# EAGLE design p (EAGLE 7.1.0)
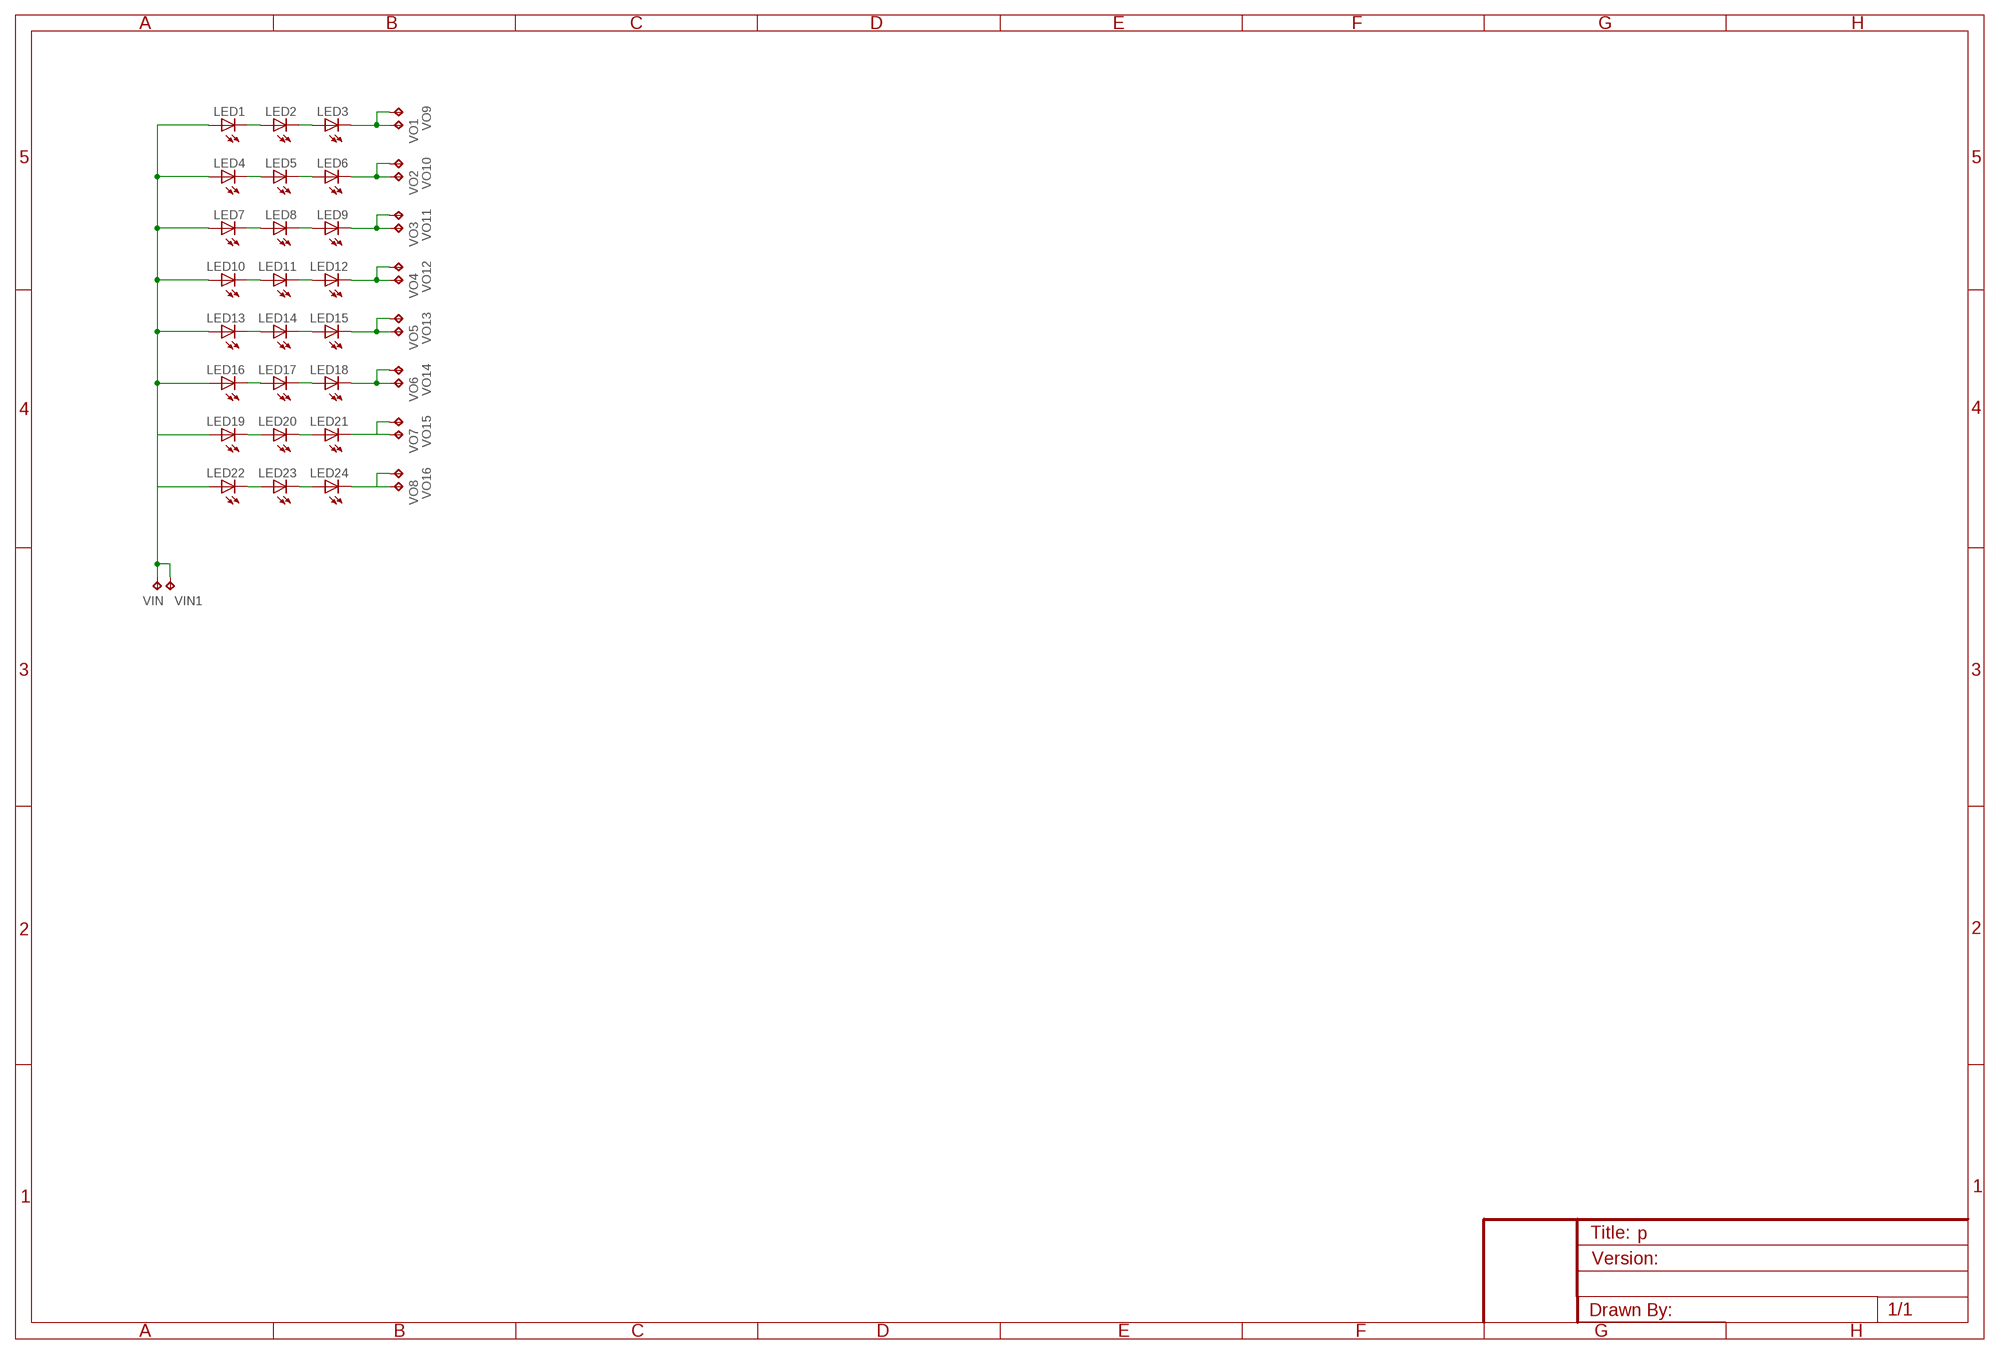
[diagram p0: schematic, sheet 1]

## Parts
LED1  LED0805  [LED_0805]
LED2  LED0805  [LED_0805]
LED3  LED0805  [LED_0805]
LED4  LED0805  [LED_0805]
LED5  LED0805  [LED_0805]
LED6  LED0805  [LED_0805]
LED7  LED0805  [LED_0805]
LED8  LED0805  [LED_0805]
LED9  LED0805  [LED_0805]
LED10  LED0805  [LED_0805]
LED11  LED0805  [LED_0805]
LED12  LED0805  [LED_0805]
LED13  LED0805  [LED_0805]
LED14  LED0805  [LED_0805]
LED15  LED0805  [LED_0805]
LED16  LED0805  [LED_0805]
LED17  LED0805  [LED_0805]
LED18  LED0805  [LED_0805]
LED19  LED0805  [LED_0805]
LED20  LED0805  [LED_0805]
LED21  LED0805  [LED_0805]
LED22  LED0805  [LED_0805]
LED23  LED0805  [LED_0805]
LED24  LED0805  [LED_0805]
VIN  TEST_POINTPAD1-20  [P1-20]
VIN1  TEST_POINTPAD1-20  [P1-20]
VO1  TEST_POINTPAD1-20  [P1-20]
VO2  TEST_POINTPAD1-20  [P1-20]
VO3  TEST_POINTPAD1-20  [P1-20]
VO4  TEST_POINTPAD1-20  [P1-20]
VO5  TEST_POINTPAD1-20  [P1-20]
VO6  TEST_POINTPAD1-20  [P1-20]
VO7  TEST_POINTPAD1-20  [P1-20]
VO8  TEST_POINTPAD1-20  [P1-20]
VO9  TEST_POINTPAD1-20  [P1-20]
VO10  TEST_POINTPAD1-20  [P1-20]
VO11  TEST_POINTPAD1-20  [P1-20]
VO12  TEST_POINTPAD1-20  [P1-20]
VO13  TEST_POINTPAD1-20  [P1-20]
VO14  TEST_POINTPAD1-20  [P1-20]
VO15  TEST_POINTPAD1-20  [P1-20]
VO16  TEST_POINTPAD1-20  [P1-20]

## Nets
N$1: LED2.C LED3.A
N$2: LED1.C LED2.A
N$3: LED19.C LED20.A
N$4: LED20.C LED21.A
N$5: LED5.C LED6.A
N$6: LED4.C LED5.A
N$7: LED22.C LED23.A
N$8: LED23.C LED24.A
N$9: LED8.C LED9.A
N$10: LED7.C LED8.A
N$11: LED24.C VO8.TP VO16.TP
N$12: LED21.C VO7.TP VO15.TP
N$13: LED11.C LED12.A
N$14: LED10.C LED11.A
N$17: LED14.C LED15.A
N$18: LED13.C LED14.A
N$21: LED17.C LED18.A
N$22: LED16.C LED17.A
VIN: LED1.A LED4.A LED7.A LED10.A LED13.A LED16.A LED19.A LED22.A VIN1.TP VIN.TP
VOUT1: LED3.C VO1.TP VO9.TP
VOUT2: LED6.C VO2.TP VO10.TP
VOUT3: LED9.C VO3.TP VO11.TP
VOUT4: LED12.C VO4.TP VO12.TP
VOUT5: LED15.C VO5.TP VO13.TP
VOUT6: LED18.C VO6.TP VO14.TP

## Library data of the parts
LED1-LED24 = CyberRailGuru:LED: LEDs Standard schematic elements and footprints for 5mm, 3mm, 1206, and 0603 sized LEDs. 5mm - Spark Fun Electronics SKU : COM-00529 (and others)
VIN VIN1 VO1-VO16 = CyberRailGuru:TEST_POINT: Test pad

## Board
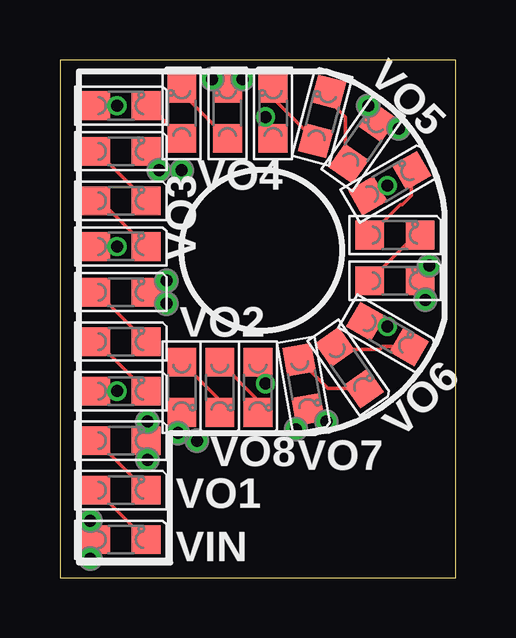
[diagram p1: board, top side]
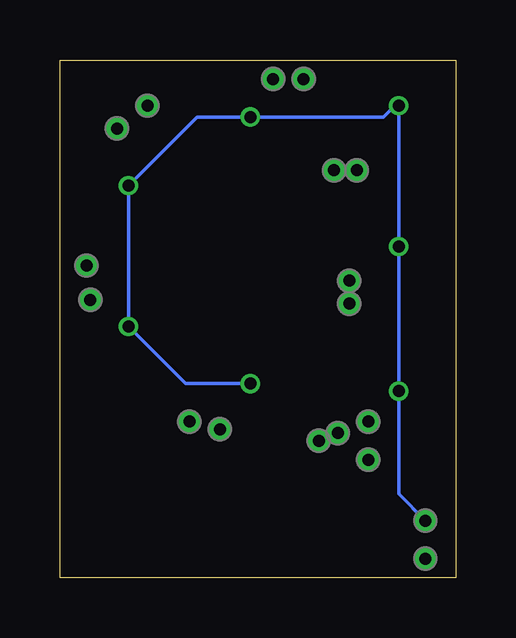
[diagram p2: board, bottom side, seen from below]

Size 16.51 x 21.59 mm. Coordinates in mm from the lower left corner, seen from the top.
Outline: 0,0 16.51,0 16.51,21.59 0,21.59 0,0
Copper layers (1*16): Top 0.035mm / dielectric 1.5mm / Bottom 0.035mm
Design rules "Fusion_eagle_rule_v1.1_tms *": minimum track width 6mil, minimum drill 12mil, track to track 6mil, track to pad 6mil, pad to pad 6mil, via to via 6mil, smd to smd 0mil, copper to edge 10mil, drill to drill 10mil, minimum pad ring 10mil, minimum via ring 6mil, stop-mask expansion 2mil, vias tented up to drill 100mil, thermal gap 10mil

### Footprints (pad centres in the part's own frame; a part is rotated, then mirrored left to right if it is on the bottom)
LED_0805 = smd 1.2 x 1.2: A 0,-1.05; C 0,1.05
P1-20 = drill 0.5: TP 0,0

### Placement (x,y rotation side)
LED1  2.54,1.59 270 top
LED2  2.54,3.65 270 top
LED3  2.54,5.71 270 top
LED4  2.54,7.78 270 top
LED5  2.54,9.84 270 top
LED6  2.54,11.91 270 top
LED7  2.54,13.81 270 top
LED8  2.54,15.72 270 top
LED9  2.54,17.78 270 top
LED10  2.54,19.68 270 top
LED11  5.08,19.37 0 top
LED12  6.99,19.37 0 top
LED13  8.89,19.37 0 top
LED14  10.94,19.24 345 top
LED15  12.64,18.13 325 top
LED16  13.75,16.45 300 top
LED17  13.97,14.29 270 top
LED18  13.97,12.38 270 top
LED19  13.65,10.16 240 top
LED20  12.07,8.76 215 top
LED21  10.17,8.05 190 top
LED22  8.26,7.94 180 top
LED23  6.67,7.94 180 top
LED24  5.08,7.94 180 top
VIN  1.27,0.79 180 top
VIN1  1.27,2.38 0 top
VO1  3.65,4.92 180 top
VO2  4.45,11.43 180 top
VO3  4.13,16.99 180 top
VO4  6.35,20.8 180 top
VO5  14.13,18.73 180 top
VO6  15.24,11.59 180 top
VO7  11.11,6.51 0 top
VO8  5.71,5.71 0 top
VO9  3.65,6.51 0 top
VO10  4.45,12.38 0 top
VO11  5.08,16.99 0 top
VO12  7.62,20.8 0 top
VO13  12.86,19.68 0 top
VO14  15.4,13.02 0 top
VO15  9.84,6.19 0 top
VO16  4.92,6.03 0 top

### Tracks (layer width: path | path; a pad name or v marks a point on that pad's centre or on a via)
N$1
  Top 0.152: LED3.A 1.53,5.71 LED2.C
N$2
  Top 0.152: LED2.A 1.53,3.65 LED1.C
N$3
  Top 0.152: LED19.C 13.45,9.63 13.34,9.53 11.56,9.53 LED20.A
N$4
  Top 0.152: LED20.C 11.17,7.9 LED21.A
N$5
  Top 0.152: LED6.A 1.53,11.91 LED5.C
N$6
  Top 0.152: LED5.A 1.53,9.84 LED4.C
N$7
  Top 0.152: LED22.C 8.26,7.4 LED23.A
N$8
  Top 0.152: LED23.C 6.67,7.4 LED24.A
N$9
  Top 0.152: LED9.A 1.53,17.78 LED8.C
N$10
  Top 0.152: LED8.A 1.69,15.72 LED7.C
N$11
  Top 0.152: LED24.C 5.08,6.19 VO16.TP 5.4,6.03 VO8.TP
N$12
  Top 0.152: VO15.TP 10.35,6.7 LED21.C 10.6,7.02 VO7.TP
N$13
  Top 0.152: LED11.C 5.08,20.22 LED12.A
N$14
  Top 0.152: LED10.C 3.71,19.68 LED11.A
N$17
  Top 0.152: LED14.C 11.21,19.91 11.91,19.21 11.91,17.41 LED15.A
N$18
  Top 0.152: LED13.C 8.89,20 LED14.A
N$21
  Top 0.152: LED17.C 14.82,14.29 LED18.A
N$22
  Top 0.152: LED16.C 14.66,15.93 14.29,15.56 14.19,15.56 LED17.A
VIN  (via drill 0.5)
  Top 0.152: VIN.TP 1.27,1.37 LED1.A 1.27,1.81 VIN1.TP 1.11,2.38 | 1.11,7.78 LED4.A v2.38,7.78 | 12.84,15.86 LED16.A 13.23,15.93 v13.65,16.35 | LED13.A 8.57,18.32 v8.57,19.21 | LED19.A 13.29,10.69 v13.65,10.48 | LED22.A 8.26,8.41 v8.57,8.1 | LED10.A v2.38,19.68 | v2.38,13.81 LED7.A
  Bottom 0.152: 13.49,10.64 v13.65,10.48 | v8.57,8.1 11.27,8.1 v13.65,10.48 | VIN1.TP 2.38,3.49 v2.38,7.78 v2.38,13.81 v2.38,19.68 2.54,19.68 3.02,19.21 v8.57,19.21 10.79,19.21 v13.65,16.35 v13.65,10.48
VOUT1
  Top 0.152: VO9.TP 3.65,5.78 LED3.C 3.65,5.65 VO1.TP
VOUT2
  Top 0.152: LED6.C 4.07,12.38 VO10.TP VO2.TP
VOUT3
  Top 0.152: LED9.C 3.59,17.52 VO3.TP VO11.TP
VOUT4
  Top 0.152: VO12.TP 7.36,20.8 LED12.C 6.61,20.8 VO4.TP
VOUT5
  Top 0.152: VO5.TP 13.51,18.73 LED15.C 12.86,19.38 VO13.TP
VOUT6
  Top 0.152: VO14.TP 15.4,12.76 LED18.C 15.24,12.16 VO6.TP

### Text on the board
201bmp: P